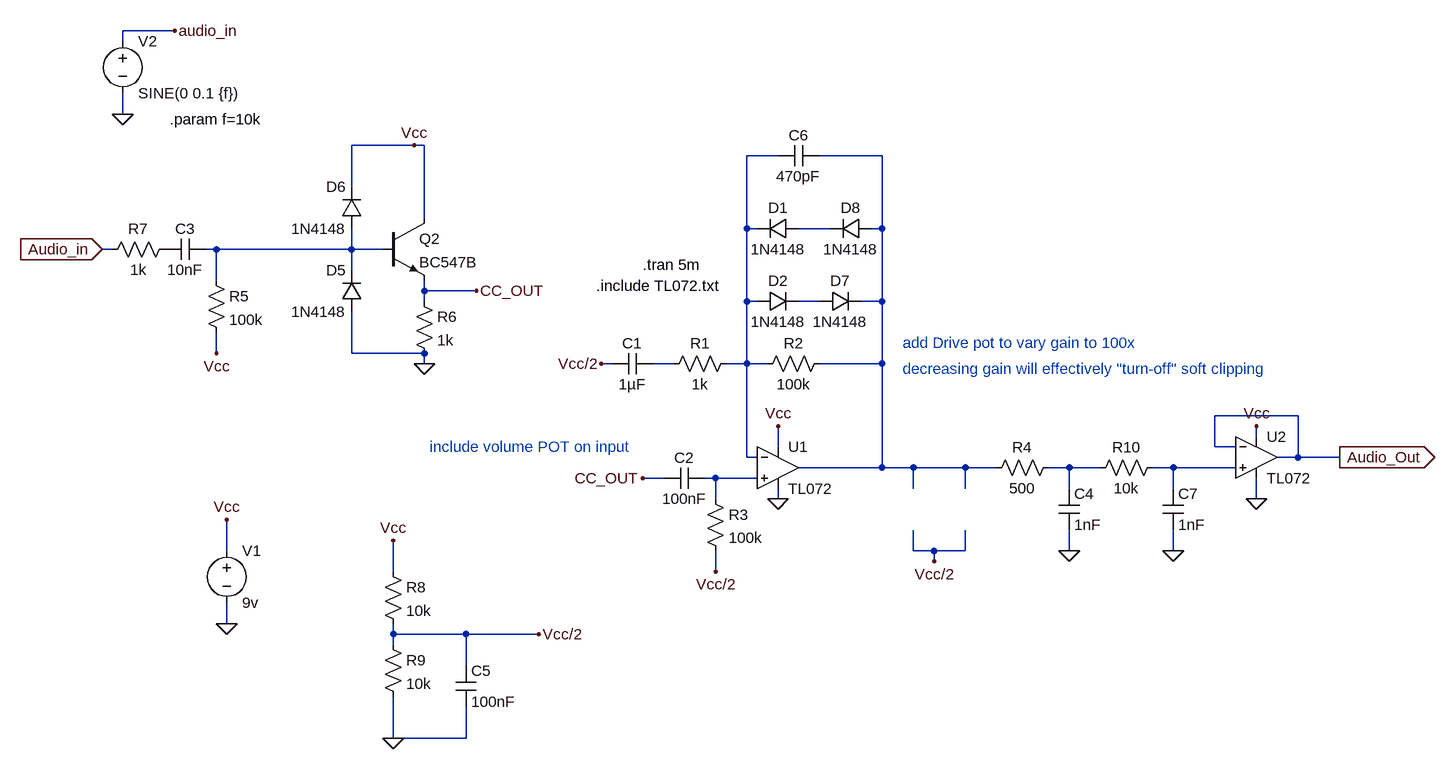
[diagram p0: schematic Distortion.asc]
Distortion.asc, the LTspice schematic file:
Version 4
SHEET 1 1332 680
WIRE -640 -1088 -720 -1088
WIRE -720 -1072 -720 -1088
WIRE -720 -960 -720 -992
WIRE -272 -912 -368 -912
WIRE -256 -912 -272 -912
WIRE 288 -896 240 -896
WIRE 448 -896 352 -896
WIRE -368 -848 -368 -912
WIRE -256 -800 -256 -912
WIRE 240 -784 240 -896
WIRE 256 -784 240 -784
WIRE 368 -784 320 -784
WIRE 448 -784 448 -896
WIRE 448 -784 432 -784
WIRE -736 -752 -752 -752
WIRE -576 -752 -592 -752
WIRE -368 -752 -368 -784
WIRE -368 -752 -576 -752
WIRE -320 -752 -368 -752
WIRE -368 -720 -368 -752
WIRE -576 -704 -576 -752
WIRE -256 -688 -256 -704
WIRE -176 -688 -256 -688
WIRE -256 -672 -256 -688
WIRE 240 -672 240 -784
WIRE 256 -672 240 -672
WIRE 352 -672 320 -672
WIRE 448 -672 448 -784
WIRE 448 -672 416 -672
WIRE -576 -592 -576 -624
WIRE -368 -592 -368 -656
WIRE -256 -592 -368 -592
WIRE -256 -576 -256 -592
WIRE 32 -576 16 -576
WIRE 128 -576 96 -576
WIRE 240 -576 240 -672
WIRE 240 -576 208 -576
WIRE 272 -576 240 -576
WIRE 448 -576 448 -672
WIRE 448 -576 352 -576
WIRE 1088 -496 960 -496
WIRE 1024 -464 1024 -480
WIRE 288 -448 288 -480
WIRE 960 -448 960 -496
WIRE 992 -448 960 -448
WIRE 240 -432 240 -576
WIRE 256 -432 240 -432
WIRE 1088 -432 1088 -496
WIRE 1088 -432 1056 -432
WIRE 1152 -432 1088 -432
WIRE 448 -416 448 -576
WIRE 448 -416 320 -416
WIRE 496 -416 448 -416
WIRE 576 -416 496 -416
WIRE 624 -416 576 -416
WIRE 736 -416 704 -416
WIRE 784 -416 736 -416
WIRE 896 -416 864 -416
WIRE 992 -416 896 -416
WIRE 112 -400 80 -400
WIRE 192 -400 176 -400
WIRE 256 -400 192 -400
WIRE 496 -384 496 -416
WIRE 576 -384 576 -416
WIRE 736 -384 736 -416
WIRE 896 -384 896 -416
WIRE 192 -368 192 -400
WIRE 288 -368 288 -384
WIRE 1024 -368 1024 -400
WIRE -560 -288 -560 -336
WIRE 496 -288 496 -320
WIRE 528 -288 496 -288
WIRE 576 -288 576 -320
WIRE 576 -288 528 -288
WIRE 736 -288 736 -320
WIRE 896 -288 896 -320
WIRE 528 -272 528 -288
WIRE -304 -256 -304 -304
WIRE 192 -256 192 -288
WIRE -560 -176 -560 -208
WIRE -304 -160 -304 -176
WIRE -192 -160 -304 -160
WIRE -80 -160 -192 -160
WIRE -304 -144 -304 -160
WIRE -192 -112 -192 -160
WIRE -304 0 -304 -64
WIRE -192 0 -192 -48
WIRE -192 0 -304 0
FLAG 80 -400 CC_OUT
FLAG 16 -576 Vcc/2
FLAG 288 -480 Vcc
FLAG -640 -1088 audio_in
FLAG -720 -960 0
FLAG -256 -576 0
FLAG -272 -912 Vcc
FLAG -576 -592 Vcc
FLAG -560 -336 Vcc
FLAG -560 -176 0
FLAG -752 -752 Audio_in
IOPIN -752 -752 In
FLAG -176 -688 CC_OUT
FLAG 528 -272 Vcc/2
FLAG 192 -256 Vcc/2
FLAG 736 -288 0
FLAG 1024 -480 Vcc
FLAG 1152 -432 Audio_Out
IOPIN 1152 -432 Out
FLAG 288 -368 0
FLAG 1024 -368 0
FLAG -304 0 0
FLAG -304 -304 Vcc
FLAG -80 -160 Vcc/2
FLAG 896 -288 0
SYMBOL res 224 -592 R90
WINDOW 0 0 56 VBottom 2
WINDOW 3 32 56 VTop 2
SYMATTR InstName R1
SYMATTR Value 1k
SYMBOL res 368 -592 R90
WINDOW 0 0 56 VBottom 2
WINDOW 3 32 56 VTop 2
SYMATTR InstName R2
SYMATTR Value 100k
SYMBOL cap 96 -592 R90
WINDOW 0 0 32 VBottom 2
WINDOW 3 32 32 VTop 2
SYMATTR InstName C1
SYMATTR Value 1µF
SYMBOL cap 176 -416 R90
WINDOW 0 0 32 VBottom 2
WINDOW 3 32 32 VTop 2
SYMATTR InstName C2
SYMATTR Value 100nF
SYMBOL voltage -720 -1088 R0
WINDOW 123 0 0 Left 2
WINDOW 39 0 0 Left 2
SYMATTR InstName V2
SYMATTR Value SINE(0 0.1 {f})
SYMBOL cap 352 -912 R90
WINDOW 0 0 32 VBottom 2
WINDOW 3 32 32 VTop 2
SYMATTR InstName C6
SYMATTR Value 470pF
SYMBOL npn -320 -800 R0
SYMATTR InstName Q2
SYMATTR Value BC547B
SYMBOL res -272 -688 R0
SYMATTR InstName R6
SYMATTR Value 1k
SYMBOL res -592 -720 R0
SYMATTR InstName R5
SYMATTR Value 100k
SYMBOL voltage -560 -304 R0
WINDOW 123 0 0 Left 2
WINDOW 39 0 0 Left 2
SYMATTR InstName V1
SYMATTR Value 9v
SYMBOL diode -352 -656 R180
WINDOW 0 24 64 Left 2
WINDOW 3 24 0 Left 2
SYMATTR InstName D5
SYMATTR Value 1N4148
SYMBOL diode -352 -784 R180
WINDOW 0 24 64 Left 2
WINDOW 3 24 0 Left 2
SYMATTR InstName D6
SYMATTR Value 1N4148
SYMBOL cap -592 -768 R90
WINDOW 0 0 32 VBottom 2
WINDOW 3 32 32 VTop 2
SYMATTR InstName C3
SYMATTR Value 10nF
SYMBOL res 176 -384 R0
SYMATTR InstName R3
SYMATTR Value 100k
SYMBOL res 720 -432 R90
WINDOW 0 0 56 VBottom 2
WINDOW 3 32 56 VTop 2
SYMATTR InstName R4
SYMATTR Value 500
SYMBOL cap 720 -384 R0
SYMATTR InstName C4
SYMATTR Value 1nF
SYMBOL Opamps\\opamp2 288 -480 R0
SYMATTR InstName U1
SYMATTR Value TL072
SYMBOL Opamps\\opamp2 1024 -496 R0
SYMATTR InstName U2
SYMATTR Value TL072
SYMBOL diode 320 -800 R90
WINDOW 0 0 32 VBottom 2
WINDOW 3 32 32 VTop 2
SYMATTR InstName D1
SYMATTR Value 1N4148
SYMBOL diode 256 -656 R270
WINDOW 0 32 32 VTop 2
WINDOW 3 0 32 VBottom 2
SYMATTR InstName D2
SYMATTR Value 1N4148
SYMBOL diode 352 -656 R270
WINDOW 0 32 32 VTop 2
WINDOW 3 0 32 VBottom 2
SYMATTR InstName D7
SYMATTR Value 1N4148
SYMBOL diode 432 -800 R90
WINDOW 0 0 32 VBottom 2
WINDOW 3 32 32 VTop 2
SYMATTR InstName D8
SYMATTR Value 1N4148
SYMBOL res -640 -768 R90
WINDOW 0 0 56 VBottom 2
WINDOW 3 32 56 VTop 2
SYMATTR InstName R7
SYMATTR Value 1k
SYMBOL res -320 -272 R0
SYMATTR InstName R8
SYMATTR Value 10k
SYMBOL res -320 -160 R0
SYMATTR InstName R9
SYMATTR Value 10k
SYMBOL cap -208 -112 R0
SYMATTR InstName C5
SYMATTR Value 100nF
SYMBOL res 880 -432 R90
WINDOW 0 0 56 VBottom 2
WINDOW 3 32 56 VTop 2
SYMATTR InstName R10
SYMATTR Value 10k
SYMBOL cap 880 -384 R0
SYMATTR InstName C7
SYMATTR Value 1nF
TEXT 80 -728 Left 2 !.tran 5m
TEXT -648 -952 Left 2 !.param f=10k
TEXT 480 -608 Left 2 ;add Drive pot to vary gain to 100x
TEXT 480 -568 Left 2 ;decreasing gain will effectively "turn-off" soft clipping
TEXT -248 -448 Left 2 ;include volume POT on input
TEXT 8 -696 Left 2 !.include TL072.txt

The netlist it stands for:
* Distortion.asc
R1 N001 N006 1k
R2 N002 N001 100k
C1 N006 Vcc/2 1µF
C2 N009 CC_OUT 100nF
V2 audio_in 0 SINE(0 0.1 {f})
C6 N002 N001 470pF
Q2 Vcc N004 CC_OUT 0 BC547B
R6 CC_OUT 0 1k
R5 N004 Vcc 100k
V1 Vcc 0 9v
D5 0 N004 1N4148
D6 N004 Vcc 1N4148
C3 N004 P001 10nF
R3 N009 Vcc/2 100k
R4 N007 N002 500
C4 N007 0 1nF
XU1 N009 N001 Vcc 0 N002 TL072  ; pins In+ In- V+ V- OUT
XU2 N008 Audio_Out Vcc 0 Audio_Out TL072  ; pins In+ In- V+ V- OUT
D1 N003 N001 1N4148
D2 N001 N005 1N4148
D7 N005 N002 1N4148
D8 N002 N003 1N4148
R7 P001 audio_in 1k
R8 Vcc Vcc/2 10k
R9 Vcc/2 0 10k
C5 Vcc/2 0 100nF
R10 N008 N007 10k
C7 N008 0 1nF
.model D D
.lib standard.dio
.model NPN NPN
.model PNP PNP
.lib standard.bjt
.tran 5m
.param f=10k
* add Drive pot to vary gain to 100x
* decreasing gain will effectively "turn-off" soft clipping
* include volume POT on input
.include TL072.txt
.backanno
.end